# Altium schematic sheet RT5621 Main V3.3.SchDoc
size A4
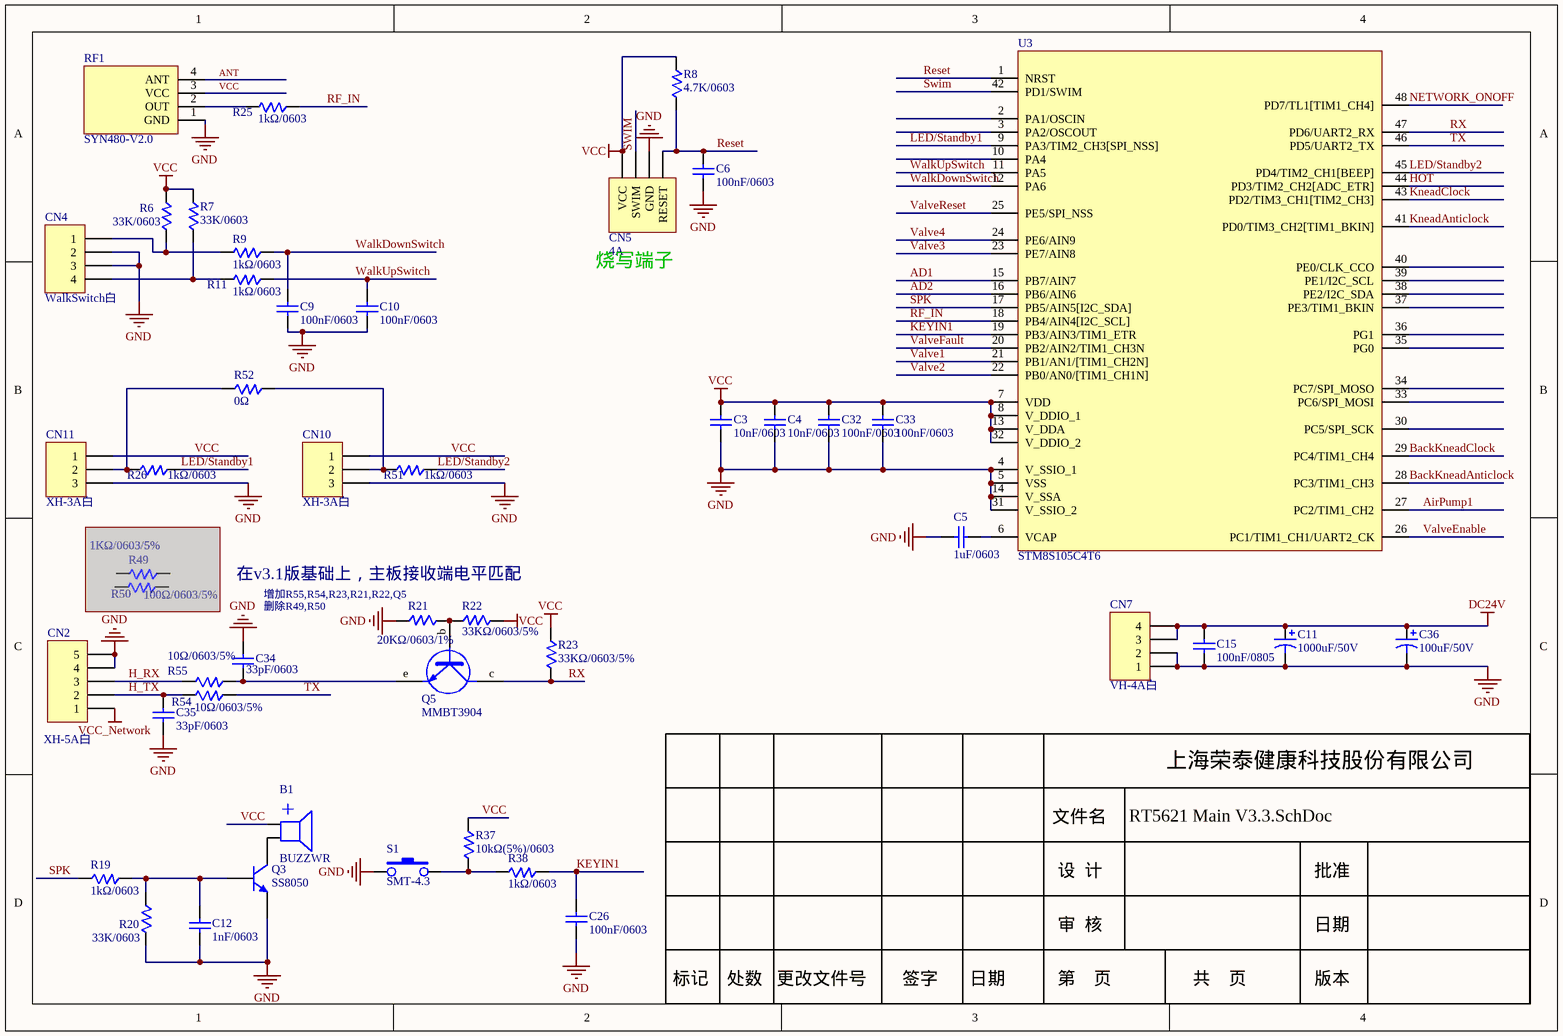
[diagram p0: RT5621 Main V3.3.SchDoc]

## Parts
B1  BUZZWR  [BUZZER]
C3  10nF/0603  [0603C]
C4  10nF/0603  [0603C]
C5  1uF/0603  [0603C]
C6  100nF/0603  [0603C]
C9  100nF/0603  [0603C]
C10  100nF/0603  [0603C]
C11  1000uF/50V  [CD16-7.5mm]
C12  1nF/0603  [0603C]
C15  100nF/0805  [0805C]
C26  100nF/0603  [0603C]
C32  100nF/0603  [0603C]
C33  100nF/0603  [0603C]
C34  33pF/0603  [0603C]
C35  33pF/0603  [0603C]
C36  100uF/50V  [RB.15/.35]
CN2  XH-5A白  [CON-XA-5P]
CN4  WalkSwitch白  [CON-XA-4P]
CN5  4A  [SIP4]
CN7  VH-4A白  [CON-VH-4P]
CN10  XH-3A白  [CON-XA-3P]
CN11  XH-3A白  [CON-XA-3P]
Q3  SS8050  [SOT-23]
Q5  MMBT3904  [SOT-23B]
R6  33K/0603  [0603]
R7  33K/0603  [0603]
R8  4.7K/0603  [0603]
R9  1kΩ/0603  [0603]
R11  1kΩ/0603  [0603]
R19  1kΩ/0603  [0603]
R20  33K/0603  [0603]
R21  20KΩ/0603/1%  [0603]
R22  33KΩ/0603/5%  [0603]
R23  33KΩ/0603/5%  [0603]
R25  1kΩ/0603  [0603]
R26  1kΩ/0603  [0603]
R37  10kΩ(5%)/0603  [0603]
R38  1kΩ/0603  [0603]
R49  1KΩ/0603/5%  [0603]  (masked out: inside a compile mask, not in the netlist)
R50  100Ω/0603/5%  [0603]  (masked out: inside a compile mask, not in the netlist)
R51  1kΩ/0603  [0603]
R52  0Ω  [0603]
R54  10Ω/0603/5%  [0603]
R55  10Ω/0603/5%  [0603]
RF1  SYN480-V2.0  [SYN480R-V2.0]
S1  SMT-4.3  [SMT-SWITCH4.3]
U3  STM8S105C4T6  [LQFP-48]

## Nets
DC24V: C11.1 C15.2 C36.1 CN7.3 CN7.4
GND: C3.1 C4.1 C5.2 C6.1 C9.2 C10.2 C11.2 C12.1 C15.1 C26.2 C32.2 C33.2 C34.2 C35.2 C36.2 CN2.4 CN2.5 CN4.2 CN4.3 CN5.3(GND) CN7.1 CN7.2 CN10.3 CN11.3 Q3.E R20.1 R21.2 RF1.1(GND) S1.1 U3.4(V_SSIO_1) U3.5(VSS) U3.14(V_SSA) U3.31(V_SSIO_2)
VCC: B1.1 C3.2 C4.2 C32.1 C33.1 CN5.1(VCC) CN10.1 CN11.1 R6.2 R7.2 R8.2 R22.1 R23.2 R37.2 RF1.3(VCC) U3.7(VDD) U3.8(V_DDIO_1) U3.13(V_DDA) U3.32(V_DDIO_2)
VCC_Network: CN2.1
AD1: U3.15(PB7/AIN7)
AD2: U3.16(PB6/AIN6)
AirPump1: U3.27(PC2/TIM1_CH2)
ANT: RF1.4(ANT)
BackKneadAnticlock: U3.28(PC3/TIM1_CH3)
BackKneadClock: U3.29(PC4/TIM1_CH4)
H_RX: CN2.3 R55.1
H_TX: C35.1 CN2.2 R54.1
HOT: U3.44(PD3/TIM2_CH2[ADC_ETR])
KEYIN1: C26.1 R38.2 U3.19(PB3/AIN3/TIM1_ETR)
KneadAnticlock: U3.41(PD0/TIM3_CH2[TIM1_BKIN])
KneadClock: U3.43(PD2/TIM3_CH1[TIM2_CH3])
LED/Standby1: R26.2 U3.9(PA3/TIM2_CH3[SPI_NSS])
LED/Standby2: R51.2 U3.45(PD4/TIM2_CH1[BEEP])
NETWORK_ONOFF: U3.48(PD7/TL1[TIM1_CH4])
Reset: C6.2 CN5.4(RESET) R8.1 U3.1(NRST)
RF_IN: R25.2 U3.18(PB4/AIN4[I2C_SCL])
RX: Q5.c R23.1 U3.47(PD6/UART2_RX)
SPK: R19.1 U3.17(PB5/AIN5[I2C_SDA])
SWIM: CN5.2(SWIM) U3.42(PD1/SWIM)
TX: R54.2 U3.46(PD5/UART2_TX)
Valve1: U3.21(PB1/AN1/[TIM1_CH2N])
Valve2: U3.22(PB0/AN0/[TIM1_CH1N])
Valve3: U3.23(PE7/AIN8)
Valve4: U3.24(PE6/AIN9)
ValveEnable: U3.26(PC1/TIM1_CH1/UART2_CK)
ValveFault: U3.20(PB2/AIN2/TIM1_CH3N)
ValveReset: U3.25(PE5/SPI_NSS)
WalkDownSwitch: C9.1 R9.2 U3.12(PA6)
WalkUpSwitch: C10.1 R11.2 U3.11(PA5)
NetB1_2: B1.2 Q3.C
NetC5_1: C5.1 U3.6(VCAP)
NetC12_2: C12.2 Q3.B R19.2 R20.2
NetC34_1: C34.1 Q5.e R55.2
NetCN4_1: CN4.1 R6.1 R9.1
NetCN4_4: CN4.4 R7.1 R11.1
NetCN10_2: CN10.2 R51.1 R52.2
NetCN11_2: CN11.2 R26.1 R52.1
NetQ5_b: Q5.b R21.1 R22.2
NetR25_1: R25.1 RF1.2(OUT)
NetR37_1: R37.1 R38.1 S1.2

Not connected (* = marked no-connect by the designer): U3 2(PA1/OSCIN) 3(PA2/OSCOUT) 10(PA4) 30(PC5/SPI_SCK) 33(PC6/SPI_MOSI) 34(PC7/SPI_MOSO) 35(PG0) 36(PG1) 37(PE3/TIM1_BKIN) 38(PE2/I2C_SDA) 39(PE1/I2C_SCL) 40(PE0/CLK_CCO)

## Notes on the sheet
- 烧写端子
- (near R21) 在v3.1版基础上，主板接收端电平匹配
- (near R21) 增加R55,R54,R23,R21,R22,Q5
- (near C34) 删除R49,R50
- 上海荣泰健康科技股份有限公司
- 文件名
- 设  计
- 批准
- 标记
- 处数
- 更改文件号
- 签字
- 日期
- 审  核
- 第    页
- 共    页
- 版本
- (in symbol BUZZWR-5V) +

## Library data of the parts
B1 = BUZZWR-5V: 物料编号: 1.01.56.002; 物料名称: 蜂鸣器5V有源(超薄)环保; 领料单位: 电子车间; 单位: 个; 仓库/库位: 内5X
C3 C4 = C0603/10nF: 物料名称: 贴片电容10nF/(10%)X7R/0603封装/环保; 领料单位: 电子车间; 单位: 个; 仓库/库位: 内5X
C5 = C0603/105M: 物料名称: 贴片电容105M/（20%）0603封装/环保; 物料编号: 1.01.25.060; 领料单位: 电子车间; 单位: 个; 仓库/库位: 内5X
C6 C9 C10 C26 C32 C33 = C0603/100nF: 物料名称: 贴片电容104M/(20%)/X7R/0603封装/环保; 物料编号: 1.01.25.056; 领料单位: 电子车间; 单位: 个; 仓库/库位: 内5X
C11 = CD-1000uF/50V/16*26: 物料名称: 电解电容1000uF/50V/16*26/环保; 物料编号: 1.01.21.042; 领料单位: 电子车间; 单位: 个; 仓库/库位: 内5X
C12 = C0603/1nF: 物料名称: 贴片电容102/(20%)/0603封装/环保; 物料编号: 1.01.25.061; 领料单位: 电子车间; 单位: 个; 仓库/库位: 内5X
C15 = C0805/104M: 物料名称: 贴片电容104M/50V/0805封装/20%/X7R/环保; 物料编号: 1.01.25.003; 领料单位: 电子车间; 单位: 个; 仓库/库位: 内5X
C34 C35 = C0603/33PF: 物料名称: 贴片电容33PF(5%)/C0G/0603封装/环保; 物料编号: 1.01.25.046; 领料单位: 电子车间; 单位: 个; 仓库/库位: 内5X
C36 = CD/100uF/50V: 物料名称: 电解电容100uF/50V/8*11/编带/环保; 物料编号: 1.01.21.024; 领料单位: 电子车间; 单位: 个; 仓库/库位: 内5X
CN2 = CON-HA-5A(白色): 物料名称: 小直角HA-5A/白色/带钩/环保; 物料编号: 1.01.57.876; 领料单位: 电子车间; 单位: 个; 仓库/库位: 内5X
CN4 = CON-HA-4A(白色): 物料名称: 带勾小直脚HA-4A(白色)/环保; 物料编号: 1.01.57.884; 领料单位: 电子车间; 单位: 个; 仓库/库位: 内5X
CN5 = CON-4A: 物料名称: 单排4芯直脚排针/2.54间距; 物料编号: 1.01.58.024; 领料单位: 电子车间; 单位: 个; 仓库/库位: 内5X
CN7 = CON-VH-4A(白色): 物料名称: 大直脚VH-4A(白色)/环保; 物料编号: 1.01.57.517; 领料单位: 电子车间; 单位: 个; 仓库/库位: 内5X
CN10 CN11 = CON-HA-3A(白色): 物料名称: 带勾小直脚HA-3A (白色）/环保; 物料编号: 1.01.57.882; 领料单位: 电子车间; 单位: 个; 仓库/库位: 内5X
Q3 = Q-SS8050/SOYT-23封装/NPN/环保: 物料名称: 贴片三极管SS8050/SOYT-23封装/NPN/环保; 物料编号: 1.01.33.016; 领料单位: 电子车间; 单位: 个; 仓库/库位: 内5X
Q5 = 贴片三极管1AM/MMBT3904/sot-23封装环保: 物料编号: 1.01.33.013; 领料单位: 电子车间; 单位: 个; 仓库/库位: 内5X; 物料名称: 贴片三极管1AM/MMBT3904/sot-23封装环保
R6 R7 R20 = R0603/33K: 物料编号: 1.01.15.117; 物料名称: 贴片电阻33K/(5%)/0603封装/环保; 领料单位: 电子车间; 单位: 个; 仓库/库位: 内5X
R8 = R0603/4.7K/(5%): 物料编号: 1.01.15.115; 物料名称: 贴片电阻4.7K/(5%)/0603封装/环保; 领料单位: 电子车间; 单位: 个; 仓库/库位: 内5X
R9 R11 R19 R25 R26 R38 R51 = R0603/1kΩ: 物料编号: 1.01.15.111; 物料名称: 贴片电阻1K/(5%)/0603封装/环保; 领料单位: 电子车间; 单位: 个; 仓库/库位: 内5X
R21 = 贴片电阻20kΩ(1%)/0603封装/环保: 物料编号: 1.01.15.113; 领料单位: 电子车间; 单位: 个; 仓库/库位: 内5X; 物料名称: 贴片电阻20kΩ(1%)/0603封装/环保
R22 R23 = 贴片电阻33K/(5%)/0603封装/环保: 物料编号: 1.01.15.117; 领料单位: 电子车间; 单位: 个; 仓库/库位: 内5X; 物料名称: 贴片电阻33K/(5%)/0603封装/环保
R37 = R0603/10kΩ/(5%): 物料编号: 1.01.15.105; 物料名称: 贴片电阻10kΩ/(5%)0603封装/环保; 领料单位: 个; 仓库/库位: 内5X
R49 = 贴片电阻1K/(5%)/0603封装/环保: 物料编号: 1.01.15.111; 领料单位: 电子车间; 单位: 个; 仓库/库位: 内5X; 物料名称: 贴片电阻1K/(5%)/0603封装/环保
R50 = 贴片电阻100Ω/(5%)0603封装: 物料编号: 1.01.15.103; 领料单位: 电子车间; 单位: 个; 仓库/库位: 内5X; 物料名称: 贴片电阻100Ω/(5%)0603封装
R52 = R0603/0Ω: 物料编号: 1.01.15.124; 物料名称: 贴片电阻0Ω/(5%)/0603封装/环保; 领料单位: 电子车间; 单位: 个; 仓库/库位: 内5X
R54 R55 = 贴片电阻10Ω/精度5%/0603封装/环保: 物料编号: 1.01.15.120; 领料单位: 电子车间; 单位: 个; 仓库/库位: 内5X; 物料名称: 贴片电阻10Ω/精度5%/0603封装/环保
RF1 = RF-315/433MH-V2.0: 物料名称: 315MHZ无线接收模块/SYN480; 物料编号: 4.2.0103307-1; 领料单位: 电子车间; 单位: 个; 仓库/库位: 内5X
S1 = SW-SMT-4.3mm: 物料编号: 1.01.52.604; 物料名称: 4.3mm贴片轻触按钮; 领料单位: 电子车间; 单位: 个; 仓库/库位: 内5X
U3 = IC-MCU-STM8S105C4T6: 物料名称: 单片机STM8S105C4T6/LQFP48/环保; 物料编号: 新物料; 领料单位: 电子车间; 单位: 个; 仓库/库位: 内5X